# Altium schematic sheet LM74910H_PINOUT.SchDoc
size B; SheetNumber: 9; SheetTotal: 11
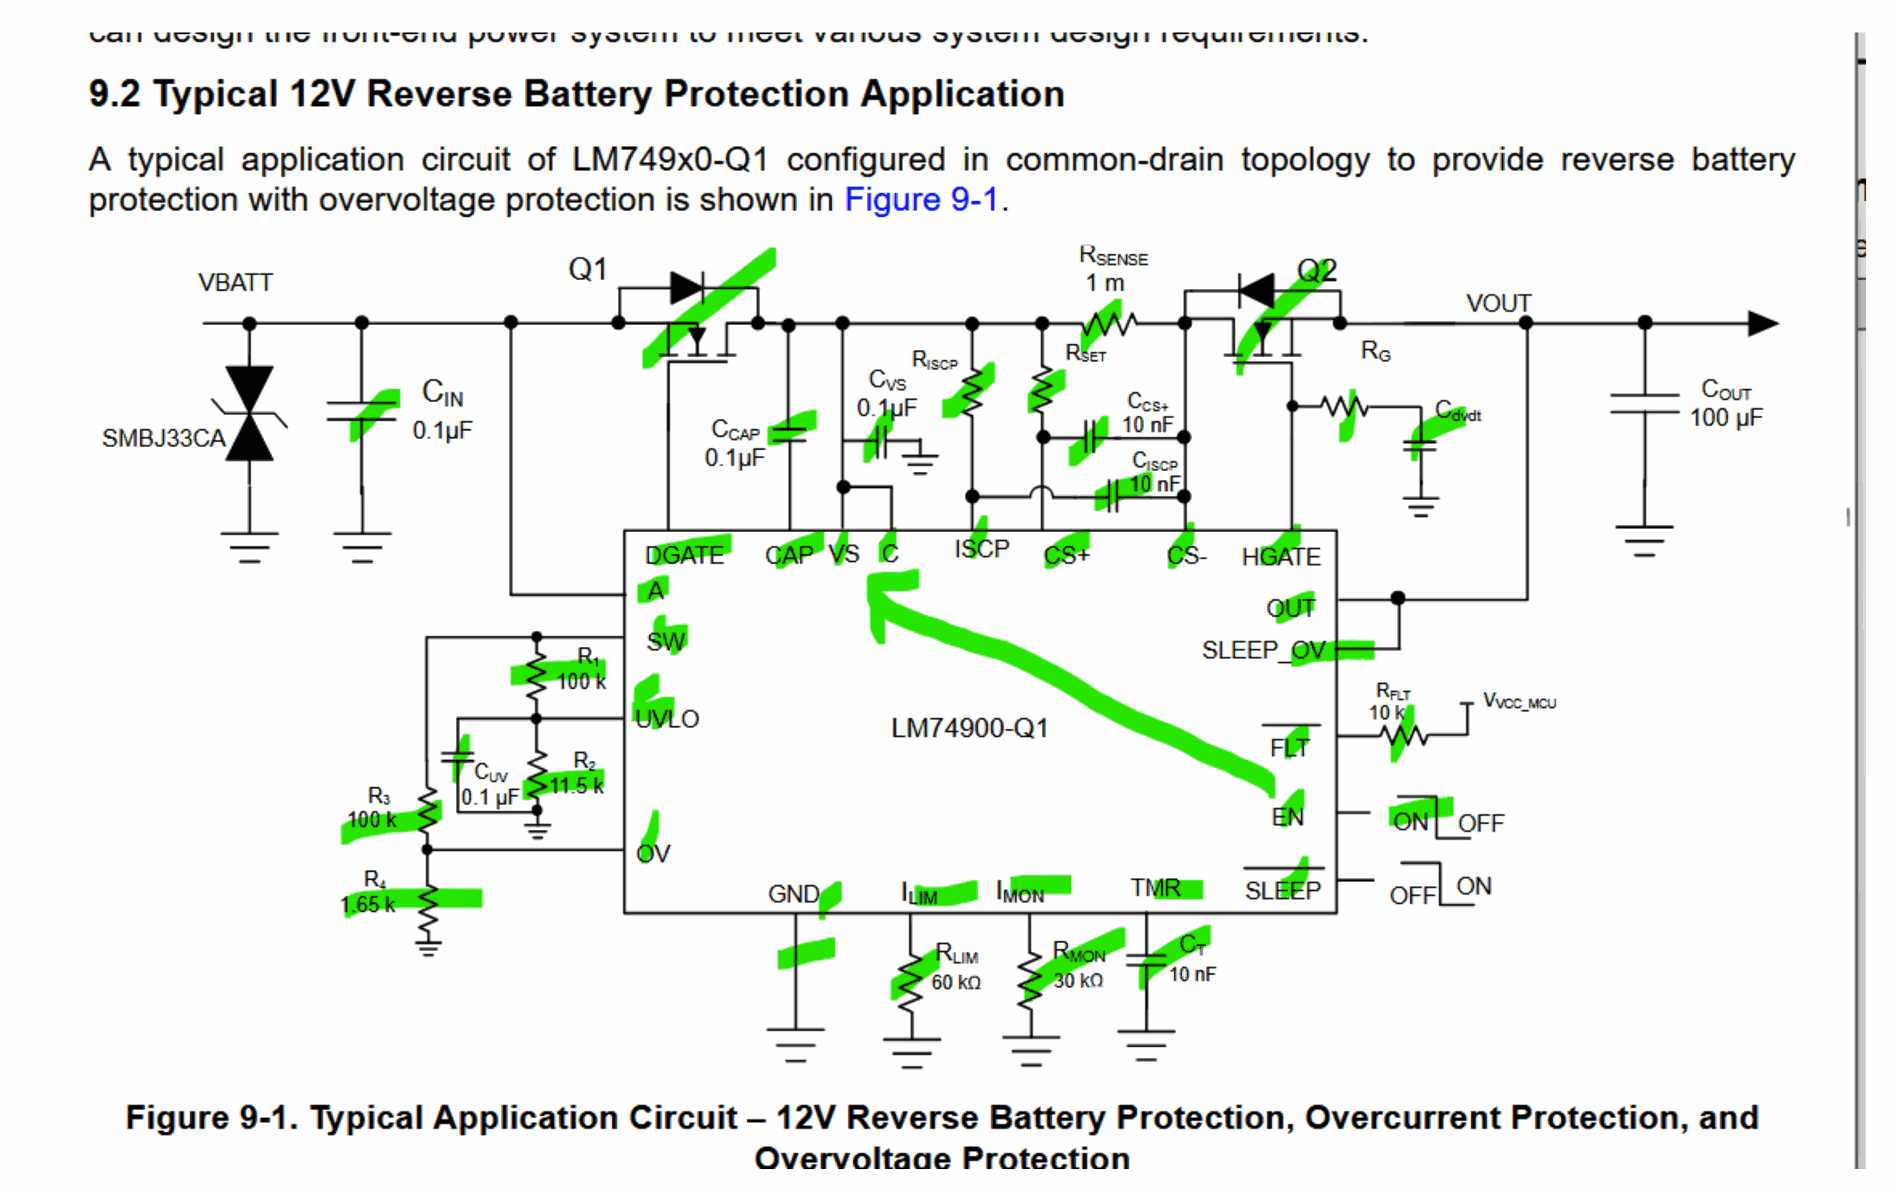
[diagram p0: LM74910H_PINOUT.SchDoc, top]
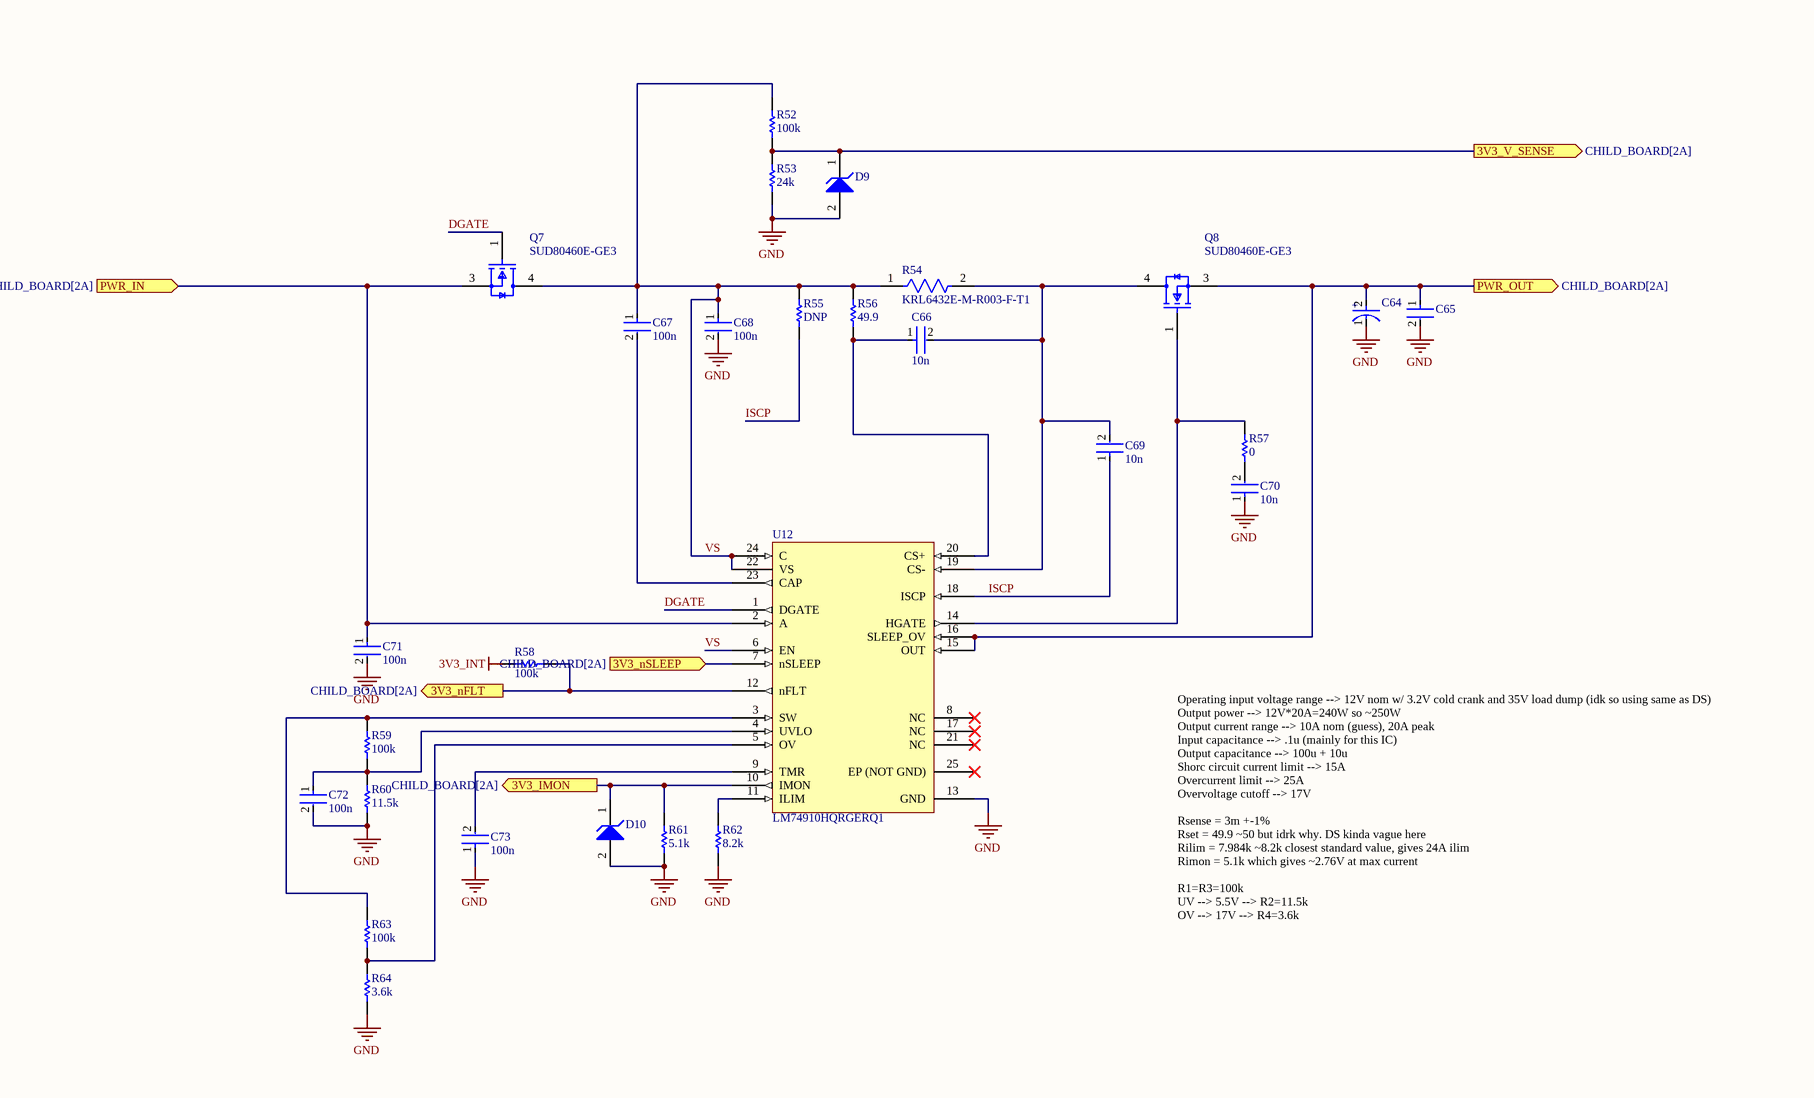
[diagram p1: LM74910H_PINOUT.SchDoc, bottom]

## Parts
C64  EEE-FK1H100UR  [FP-FKC-MFG]  (value not drawn)
C65  12103D106KAT2A  [FP-1210-L_3_3_0_4-W_2_5_0-MFG]  (value not drawn)
C66  10n  [FP-0402-L_1_0_0_05-W_0_5-IPC_A]
C67  100n  [FP-0402-L_1_0_0_05-W_0_5-IPC_A]
C68  100n  [FP-0402-L_1_0_0_05-W_0_5-IPC_A]
C69  10n  [FP-0402-L_1_0_0_05-W_0_5-IPC_A]
C70  10n  [FP-0402-L_1_0_0_05-W_0_5-IPC_A]
C71  100n  [FP-0402-L_1_0_0_05-W_0_5-IPC_A]
C72  100n  [FP-0402-L_1_0_0_05-W_0_5-IPC_A]
C73  100n  [FP-0402-L_1_0_0_05-W_0_5-IPC_A]
D9  DNP/MM5Z3V3T1G  [ONSC-SOD-523-2-502-01_V]  (value not drawn)
D10  DNP/MM5Z3V3T1G  [ONSC-SOD-523-2-502-01_V]  (value not drawn)
Q7  SUD80460E-GE3  [FP-T16-0236-MFG]
Q8  SUD80460E-GE3  [FP-T16-0236-MFG]
R52  100k  [R0603B]
R53  24k  [R0603B]
R54  KRL6432E-M-R003-F-T1  [FP-KRL6432E-MFG]
R55  DNP  [R0603B]
R56  49.9  [R0603B]
R57  0  [R0603B]
R58  100k  [R0603B]
R59  100k  [R0603B]
R60  11.5k  [R0603B]
R61  5.1k  [R0603B]
R62  8.2k  [R0603B]
R63  100k  [R0603B]
R64  3.6k  [R0603B]
U12  LM74910HQRGERQ1  [QFN50P400X400X100_HS-25N]

## Ports
3V3_IMON (out, see CHILD_BOARD[2A]), 3V3_nFLT (out, see CHILD_BOARD[2A]), 3V3_nSLEEP (in, see CHILD_BOARD[2A]), 3V3_V_SENSE (out, see CHILD_BOARD[2A]), PWR_IN (in, see CHILD_BOARD[2A]), PWR_OUT (out, see CHILD_BOARD[2A])

## Nets
3V3_INT: R58.2
GND: C64.1(C) C65.2 C68.2 C70.1 C71.2 C72.2 C73.1 D9.2(A) D10.2(A) R53.1 R60.1 R61.1 R62.1 R64.1 U12.13(GND)
3V3_IMON: D10.1(K) R61.2 U12.10(IMON) ; port 3V3_IMON
3V3_nFLT: R58.1 U12.12(nFLT) ; port 3V3_nFLT
3V3_nSLEEP: U12.7(nSLEEP) ; port 3V3_nSLEEP
3V3_V_SENSE: D9.1(K) R52.1 R53.2 ; port 3V3_V_SENSE
DGATE: Q7.1(G) U12.1(DGATE)
ISCP: C69.1 R55.1 U12.18(ISCP)
PWR_IN: C71.1 Q7.3(S) U12.2(A) ; port PWR_IN
PWR_OUT: C64.2(A) C65.1 Q8.3(S) U12.15(OUT) U12.16(SLEEP_OV) ; port PWR_OUT
VS: C67.1 C68.1 Q7.4(D) R52.2 R54.1 R55.2 R56.2 U12.6(EN) U12.22(VS) U12.24(C)
NetC66_1: C66.1 R56.1 U12.20(CS+)
NetC66_2: C66.2 C69.2 Q8.4(D) R54.2 U12.19(CS-)
NetC67_2: C67.2 U12.23(CAP)
NetC70_2: C70.2 R57.1
NetC72_1: C72.1 R59.1 R60.2 U12.4(UVLO)
NetC73_2: C73.2 U12.9(TMR)
NetQ8_1: Q8.1(G) R57.2 U12.14(HGATE)
NetR59_2: R59.2 R63.2 U12.3(SW)
NetR62_2: R62.2 U12.11(ILIM)
NetR63_1: R63.1 R64.2 U12.5(OV)

Not connected (* = marked no-connect by the designer): U12 8(NC)* 17(NC)* 21(NC)* 25(EP_(NOT_GND))*

## Notes on the sheet
- Operating input voltage range --> 12V nom w/ 3.2V cold crank and 35V load dump (idk so using same as DS)
  Output power --> 12V*20A=240W so ~250W
  Output current range --> 10A nom (guess), 20A peak
  Input capacitance --> .1u (mainly for this IC)
  Output capacitance --> 100u + 10u
  Shorc circuit current limit --> 15A
  Overcurrent limit --> 25A
  Overvoltage cutoff --> 17V
  Rsense = 3m +-1%
  Rset = 49.9 ~50 but idrk why. DS kinda vague here
  Rilim = 7.984k ~8.2k closest standard value, gives 24A ilim
  Rimon = 5.1k which gives ~2.76V at max current
  R1=R3=100k
  UV --> 5.5V --> R2=11.5k
  OV --> 17V --> R4=3.6k
- (in symbol CMP-05427-000030-1) +

## Library data of the parts
C64 = CMP-05427-000030-1: CAP ALUM 10UF 20% 50V SMD; Impedance: 1.52R; Ripple Current (AC): 85mA; Life (Hours): 2000Hour; Leakage Current: 3uA; Dielectric Material: Aluminium; Length: 5.8mm; Voltage Rating: 50V; Radiation Hardening: No; Max Operating Temperature: 105°C; REACH SVHC: No SVHC; Tolerance: 20%; RoHS Compliant: Yes; Case/Package: Radial; Height: 5.8mm; Voltage: 50V; Diameter: 5mm; Number of Pins: 2; Ripple Current: 85mA; Series: FK; Lead Free: Lead Free; Width: 6.5mm; ESR (Equivalent Series Resistance): 1.52R; Package Quantity: 1000; Construction: Cylindrical; Voltage Rating (DC): 50V; Packaging: Tape and Reel; Height - Seated (Max): 0.228inch; Contact Plating: Tin; Capacitance: 10uF; Min Operating Temperature: -55°C; Termination: SMD/SMT; Material: Aluminium; Mount: Surface Mount
C65 = CMP-2000-05477-2: General Purpose Ceramic Capacitor, 1210, 10uF, 10%, X5R, 15%, 25V; Lead Free: Lead Free; Max Operating Temperature: 85°C; REACH SVHC: No SVHC; Depth: 2.5mm; Packaging: Tape and Reel; Min Operating Temperature: -55°C; Height: 2.29mm; Construction: Flat; Case Code (Imperial): 1210; Radiation Hardening: No; Voltage: 25V; Case/Package: 1210; Series: -; Dielectric: X5R; Length: 3.2mm; Thickness: 0.11inch; Package Quantity: 1; Termination: SMD/SMT; Case Code (Metric): 3225; Voltage Rating (DC): 25V; Voltage Rating: 25V; Contact Plating: Tin; RoHS Compliant: Yes; Mount: Surface Mount; Width: 0.098inch; Capacitance: 10uF; Tolerance: 10%
C66-C73 = CMP-001-00058-1: LARGE PADS, 0402 CAP, CHANGE COMMENT TO MATCH REAL P/N; Capacitor Type: Ceramic; Min Operating Temperature: -55°C; Mounting Technology: Surface Mount; Pins: 2; Case/Package: 0402; RoHS Compliant: Yes; Max Operating Temperature: 85°C
D9 D10 = CMP-1060-00750-1: Zener Voltage Regulator, 500 mW, 2-Pin SOD-523, Pb-Free, Tape and Reel; Manufacturer: On Semiconductor; P Max (W): 0.5; VZ Typ (V): 3.3; RoHS: Pb-Free; ComponentLink2Description: Datasheet; PackageReference: SOD-523-2-502-01; DatasheetVersion: Rev. 10; ComponentLink1Description: Manufacturer URL; PackageVersion: Rev. E, 09/2010; ComponentLink3URL: http://www.onsemi.com/pub_link/Collateral/502-01.PDF; ComponentLink2URL: http://www.onsemi.cn/pub_link/Collateral/MM5Z2V4T1-D.PDF; Mounting Technology: Surface Mount; PartNumber: MM5Z3V3T1G; Packing: Tape and Reel; PackageDescription: 2-Pin SOD, Body 1.2 x 0.8 mm; ComponentLink1URL: http://www.onsemi.com/; ComponentLink3Description: Package Specification
Q7 Q8 = CMP-02550-000179-1: MOSFET N-CH 150V 42A TO252AA; Manufacturer: Vishay; Rthja Max: 50°C/W; Number Of N Channels: 1; Max Junction Temp: +175°C; Power Dissipation: 65.2W; Reverse Recovery Charge: 210nC; Reverse Recovery Time: 68ns; Threshold Vgs Max: 4V; Input Capacitace At Vds: 560pF @ 50V; Drain To Source Resistance: 0.0372Ω; Max Forward Diode Voltage: 1.5V; Gate Charge At Vgs: 10.5nC @ 10V; Threshold Vgs Min: 2V; Transconductance: 11S; Typ Forward Diode Voltage: 0.85V; Turn On Delay Time: 8ns; Turn Off Delay Time: 15ns; Gate To Source Voltage: 20V; Depletion Mode: False; Pulse Drain Current: 40A; Automotive: No; Drain To Source Voltage: 150V; ComponentLink2Description: Datasheet; Octopart: https://octopart.com/sud80460e-ge3-vishay-78440626; Device Class L2: Transistors; Lead Free: Yes; Device Class L3: MOSFETs; Temperature Range High: +175°C; Continuous Drain Current: 42A; Temperature: -55°C to +175°C; Footprint Url: https://www.vishay.com/docs/71197/to252aa.pdf; Manufacturer Part Number: SUD80460E-GE3; Package: T16-0236; ComponentLink2URL: https://www.vishay.com/docs/76248/sud80460e.pdf; Device Class L1: Discrete Semiconductors; Digikey Description: MOSFET N-CH 150V 42A TO252AA; Number Of Channels: 1; Category: Trans; Temperature Range Low: -55°C; Height: 2.507mm; RoHS: TRUE; Drain To Source Breakdown Voltage: 150V
R52 R53 R55-R64 = CMP-009-00002-14: Resistor
R54 = CMP-00597-24927456-1: KRL6432E-M-R003-F-T1 Metal Foil Low Resistance Chip Resistor (long-side terminal), 2512, RoHS; Tolerance: 1%; Resistance: 3mΩ; Temperature Coefficient: 50ppm/°C; Power Rating: 3W; Height: 700µm; NexarPartId: 24927456; Termination: SMD/SMT; Case Code (Metric): 6432; Min Operating Temperature: -55°C; Length: 3.1mm; Weight: 40.511469mg; Width: 6.3mm; Lifecycle Status: Production; Max Operating Temperature: 155°C; Case Code (Imperial): 2512; Composition: Metal Foil; Case/Package: 2512; Max Thickness: 700µm; RoHS: Compliant
U12 = CMP-019-00057-1: Automotive ideal diode with circuit breaker, 200-kHz ACS, UV , OV protection and SLEEP mode 24-VQFN -40 to 125; Pins: 24; Case/Package: VQFN